# EAGLE design ArduTX_TX_Battery_Powered (EAGLE 6.6.0)
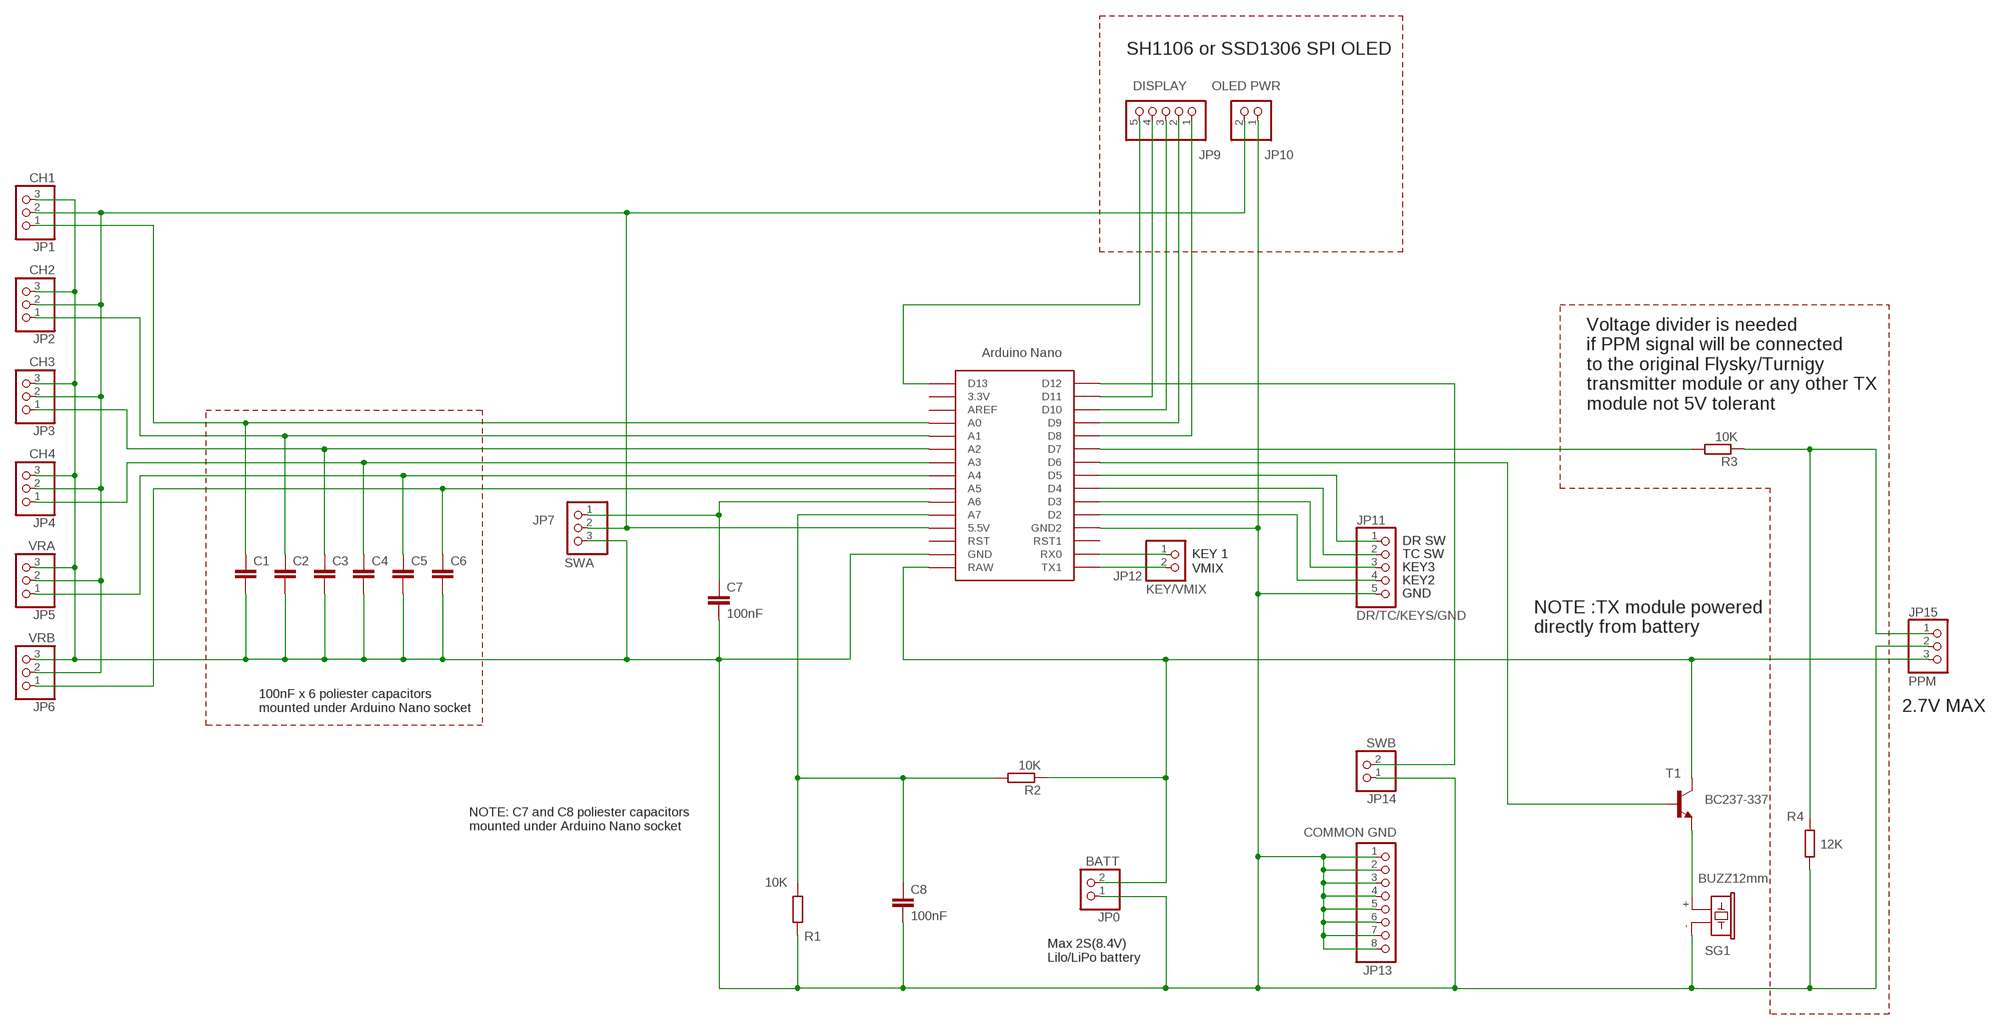
[diagram p0: schematic, sheet 1]

## Parts
ARDUINO-NANO  NANO  [NANO]
C1  C-EU050-025X075  [C050-025X075]
C2  C-EU050-025X075  [C050-025X075]
C3  C-EU050-025X075  [C050-025X075]
C4  C-EU050-025X075  [C050-025X075]
C5  C-EU050-025X075  [C050-025X075]
C6  C-EU050-025X075  [C050-025X075]
C7  100nF  C-EU050-025X075  [C050-025X075]
C8  100nF  C-EU050-025X075  [C050-025X075]
JP0  BATT  PINHD-1X2  [1X02]
JP1  CH1  PINHD-1X3  [1X03]
JP2  CH2  PINHD-1X3  [1X03]
JP3  CH3  PINHD-1X3  [1X03]
JP4  CH4  PINHD-1X3  [1X03]
JP5  VRA  PINHD-1X3  [1X03]
JP6  VRB  PINHD-1X3  [1X03]
JP7  SWA  PINHD-1X3  [1X03]
JP9  DISPLAY  PINHD-1X5  [1X05]
JP10  OLED PWR  PINHD-1X2  [1X02]
JP11  DR/TC/KEYS/GND  PINHD-1X5  [1X05]
JP12  KEY/VMIX  PINHD-1X2  [1X02]
JP13  COMMON GND  PINHD-1X8  [1X08]
JP14  SWB  PINHD-1X2  [1X02]
JP15  PPM  PINHD-1X3  [1X03]
R1  10K  R-EU_0207/8  [0207/8]
R2  10K  R-EU_0207/8  [0207/8]
R3  10K  R-EU_0207/8  [0207/8]
R4  12K  R-EU_0207/8  [0207/8]
SG1  BUZZ12mm  F/CM12P  [F/CM12P]
T1  BC237-337  BC337  [TO92]

## Nets
N$1: ARDUINO-NANO.TX0(TX1) JP12.2
N$2: ARDUINO-NANO.5V(5.5V) JP1.2 JP2.2 JP3.2 JP4.2 JP5.2 JP6.2 JP7.2 JP10.2
N$3: ARDUINO-NANO.A0 C1.1 JP1.1
N$4: ARDUINO-NANO.A1 C2.1 JP2.1
N$5: ARDUINO-NANO.A2 C3.1 JP3.1
N$6: ARDUINO-NANO.A3 C4.1 JP4.1
N$7: ARDUINO-NANO.A4 C5.1 JP5.1
N$8: ARDUINO-NANO.A5 C6.1 JP6.1
N$9: ARDUINO-NANO.D6 T1.2(B)
N$10: SG1.+ T1.1(E)
N$11: ARDUINO-NANO.D7 R3.2
N$12: ARDUINO-NANO.RX1(RX0) JP12.1
N$13: ARDUINO-NANO.D4 JP11.2
N$14: ARDUINO-NANO.D5 JP11.1
N$15: ARDUINO-NANO.A6 C7.1 JP7.1
N$16: ARDUINO-NANO.D3 JP11.3
N$17: ARDUINO-NANO.D2 JP11.4
N$20: ARDUINO-NANO.A7 C8.1 R1.1 R2.2
N$21: ARDUINO-NANO.D12 JP14.2
N$22: ARDUINO-NANO.GND ARDUINO-NANO.GND1(GND2) C1.2 C2.2 C3.2 C4.2 C5.2 C6.2 C7.2 C8.2 JP0.1 JP1.3 JP2.3 JP3.3 JP4.3 JP5.3 JP6.3 JP7.3 JP10.1 JP11.5 JP13.1 JP13.2 JP13.3 JP13.4 JP13.5 JP13.6 JP13.7 JP13.8 JP14.1 JP15.2 R1.2 R4.1 SG1.-
N$28: ARDUINO-NANO.D10 JP9.3
N$30: ARDUINO-NANO.D9 JP9.2
N$31: ARDUINO-NANO.D8 JP9.1
N$32: ARDUINO-NANO.D11 JP9.4
N$33: ARDUINO-NANO.D13 JP9.5
N$34: JP15.1 R3.1 R4.2
NET: ARDUINO-NANO.RAW JP0.2 JP15.3 R2.1 T1.3(C)
Unconnected: ARDUINO-NANO.3.3V ARDUINO-NANO.AREF ARDUINO-NANO.RST ARDUINO-NANO.RST1

## Notes on the sheet
- SH1106 or SSD1306 SPI OLED
- Voltage divider is needed 
  if PPM signal will be connected 
  to the original Flysky/Turnigy 
  transmitter module or any other TX
  module not 5V tolerant
- DR SW
- KEY 1 | TC SW
- VMIX | KEY3
- KEY2
- GND
- NOTE :TX module powered 
  directly from battery
- 100nF x 6 poliester capacitors
  mounted under Arduino Nano socket
- 2.7V MAX
- NOTE: C7 and C8 poliester capacitors
  mounted under Arduino Nano socket
- Max 2S(8.4V) 
  Lilo/LiPo battery

## Library data of the parts
ARDUINO-NANO = ArduTX:NANO: Arduino Nano
C1-C8 = ArduTX:C-EU: CAPACITOR, European symbol
JP0 JP10 JP12 JP14 = ArduTX:PINHD-1X2: PIN HEADER
JP1-JP7 JP15 = ArduTX:PINHD-1X3: PIN HEADER
JP9 JP11 = ArduTX:PINHD-1X5: PIN HEADER
JP13 = ArduTX:PINHD-1X8: PIN HEADER
R1-R4 = ArduTX:R-EU_: RESISTOR, European symbol
SG1 = ArduTX:F/CM12P: BUZZER Source: Buerklin; OC_FARNELL: unknown; OC_NEWARK: unknown
T1 = ArduTX:BC337*: NPN Transistor

## Board
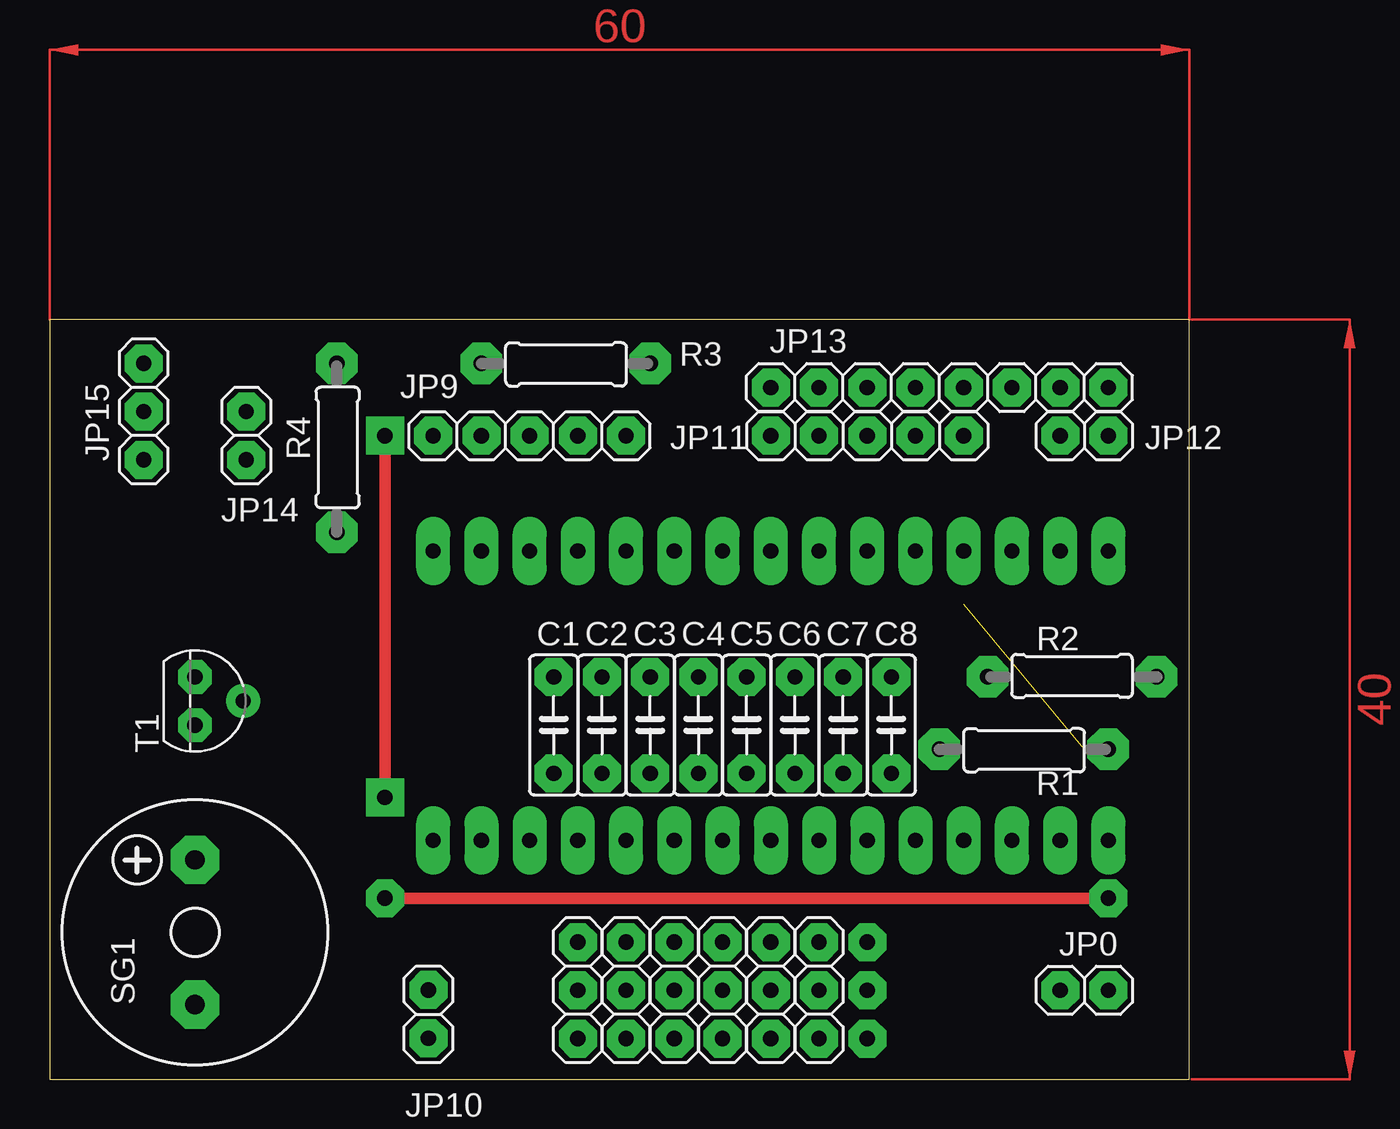
[diagram p1: board, top side]
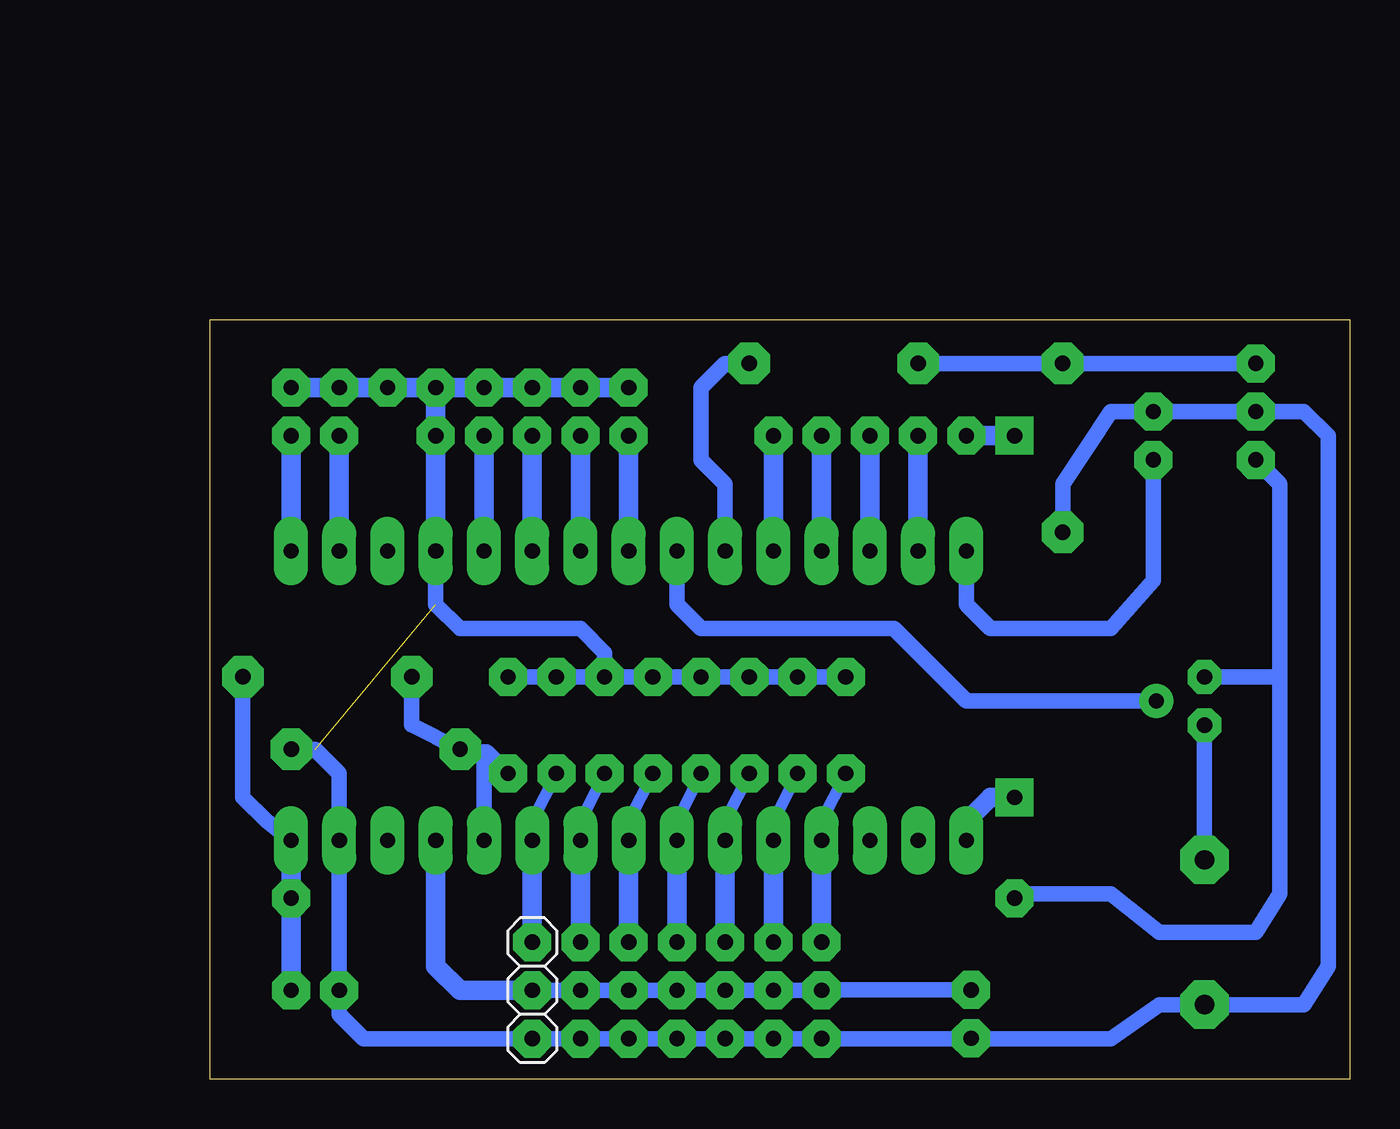
[diagram p2: board, bottom side, seen from below]

Size 60 x 40 mm. Coordinates in mm from the lower left corner, seen from the top.
Outline: 0,0 60,0 60,40 0,40 0,0
Copper layers (1*16): Top 0.035mm / dielectric 1.5mm / Bottom 0.035mm
Design rules "default": minimum track width 10mil, minimum drill 24mil, track to track 8mil, track to pad 8mil, pad to pad 8mil, via to via 8mil, smd to smd 8mil, copper to edge 40mil, drill to drill 8mil, minimum pad ring 10mil, minimum via ring 8mil, stop-mask expansion 4mil, vias tented up to drill 0mil, thermal gap 10mil

### Footprints (pad centres in the part's own frame; a part is rotated, then mirrored left to right if it is on the bottom)
NANO = drill 0.8 pad 1.8 long: 3.3V -10.16,24.13; 5V -10.16,-1.27; A0 -10.16,19.05; A1 -10.16,16.51; A2 -10.16,13.97; A3 -10.16,11.43; A4 -10.16,8.89; A5 -10.16,6.35; A6 -10.16,3.81; A7 -10.16,1.27; AREF -10.16,21.59; D2 5.08,1.27; D3 5.08,3.81; D4 5.08,6.35; D5 5.08,8.89; D6 5.08,11.43; D7 5.08,13.97; D8 5.08,16.51; D9 5.08,19.05; D10 5.08,21.59; D11 5.08,24.13; D12 5.08,26.67; D13 -10.16,26.67; GND -10.16,-6.35; GND1 5.08,-1.27; RAW -10.16,-8.89; RST -10.16,-3.81; RST1 5.08,-3.81; RX1 5.08,-6.35; TX0 5.08,-8.89
C050-025X075 = drill 0.8 pad 2 octagon: 1 -2.54,0; 2 2.54,0
1X02 = drill 0.8 pad 2 octagon: 1 -1.27,0; 2 1.27,0
1X03 = drill 0.8 pad 2 octagon: 1 -2.54,0; 2 0,0; 3 2.54,0
1X05 = drill 0.8 pad 2 octagon: 1 -5.08,0; 2 -2.54,0; 3 0,0; 4 2.54,0; 5 5.08,0
1X08 = drill 0.8 pad 2 octagon: 1 -8.89,0; 2 -6.35,0; 3 -3.81,0; 4 -1.27,0; 5 1.27,0; 6 3.81,0; 7 6.35,0; 8 8.89,0
0207/8 = drill 0.813 pad 2.184 octagon: 1 -3.81,0; 2 5.08,0
F/CM12P = drill 1.016 pad 2.54 octagon: + 3.81,0; - -3.81,0
TO92 = drill 0.8 pad 1.778 octagon: 1 1.27,0; 3 -1.27,0 | drill 0.8 pad 1.778: 2 0,2.54

### Placement (x,y rotation side)
ARDUINO-NANO  46.85,22.73 90 top
C1  26.53,18.64 90 top
C2  29.07,18.64 90 top
C3  31.61,18.64 90 top
C4  34.15,18.64 90 top
C5  36.69,18.64 90 top
C6  39.23,18.64 90 top
C7  41.77,18.64 90 top
C8  44.31,18.64 90 top
JP0  54.47,4.67 0 top
JP1  27.8,4.67 270 top
JP2  30.34,4.67 270 top
JP3  32.88,4.67 270 top
JP4  35.42,4.67 270 top
JP5  37.96,4.67 270 top
JP6  40.5,4.67 270 top
JP7  43.04,4.67 270 bottom
JP9  25.26,33.88 180 top
JP10  19.93,3.42 90 top
JP11  43.04,33.88 0 top
JP12  54.47,33.88 0 top
JP13  46.85,36.42 180 top
JP14  10.34,33.88 270 top
JP15  4.94,35.15 270 top
R1  50.65,17.37 0 top
R2  54.47,21.18 180 top
R3  26.53,37.69 0 top
R4  15.1,32.61 90 top
SG1  7.64,7.73 90 top
T1  7.64,19.91 270 top

### Tracks (layer width: path | path; a pad name or v marks a point on that pad's centre or on a via)
N$1
  Bottom 1.016: JP12.2 ARDUINO-NANO.TX0
N$2
  Bottom 0.813: JP7.2 JP6.2 JP5.2 JP4.2 JP3.2 JP2.2 JP1.2 27.78,4.69 JP10.2 19.91,4.67
  Bottom 1.016: JP7.2 46.85,4.67 48.12,5.94 ARDUINO-NANO.5V
N$3
  Bottom 0.61: C1.1 27.8,13.56 ARDUINO-NANO.A0
  Bottom 1.016: ARDUINO-NANO.A0 JP1.1
N$4
  Bottom 0.61: C2.1 30.34,13.56 ARDUINO-NANO.A1
  Bottom 1.016: ARDUINO-NANO.A1 JP2.1
N$5
  Bottom 0.61: C3.1 32.88,13.56 ARDUINO-NANO.A2
  Bottom 1.016: ARDUINO-NANO.A2 JP3.1
N$6
  Bottom 0.61: C4.1 35.42,13.56 ARDUINO-NANO.A3
  Bottom 1.016: ARDUINO-NANO.A3 JP4.1
N$7
  Bottom 0.61: C5.1 37.96,13.56 ARDUINO-NANO.A4
  Bottom 1.016: ARDUINO-NANO.A4 JP5.1
N$8
  Bottom 0.61: C6.1 40.5,13.56 ARDUINO-NANO.A5
  Bottom 1.016: ARDUINO-NANO.A5 JP6.1
N$9
  Bottom 0.813: ARDUINO-NANO.D6 35.42,24.99 34.15,23.72 23.99,23.72 20.18,19.91 T1.2
N$10
  Bottom 0.813: T1.1 SG1.+
N$11
  Bottom 0.813: ARDUINO-NANO.D7 32.88,31.34 34.15,32.61 34.15,36.42 32.88,37.69 R3.2
N$12
  Bottom 1.016: JP12.1 ARDUINO-NANO.RX1
N$13
  Bottom 1.016: JP11.2 ARDUINO-NANO.D4
N$14
  Bottom 1.016: JP11.1 ARDUINO-NANO.D5
N$15
  Bottom 0.61: C7.1 43.04,13.56 ARDUINO-NANO.A6
  Bottom 1.016: ARDUINO-NANO.A6 JP7.1
N$16
  Bottom 1.016: JP11.3 ARDUINO-NANO.D3
N$17
  Bottom 1.016: JP11.4 ARDUINO-NANO.D2
N$20
  Bottom 0.61: 46.71,17.24 R1.1
  Bottom 0.813: R1.1 49.39,18.64 R2.2 | 46.71,17.24 45.58,17.24 | 45.58,17.24 45.45,17.24 C8.1 | ARDUINO-NANO.A7 45.58,17.24
N$21
  Bottom 0.813: ARDUINO-NANO.D12 20.18,24.99 18.91,23.72 12.56,23.72 10.34,26.26 JP14.2
N$22  (1 unrouted)
  Bottom 0.813: 19.93,2.13 JP1.3 JP2.3 JP3.3 JP4.3 JP5.3 JP6.3 JP7.3 51.93,2.13 53.2,3.4 JP0.1 ARDUINO-NANO.GND 53.2,16.1 54.47,17.37 R1.2 | 19.91,2.13 JP10.1 19.93,2.13 | 19.93,2.13 12.56,2.13 10.02,3.92 SG1.- 2.4,3.92 1.13,5.94 1.13,33.88 2.4,35.15 JP15.2 JP14.1 12.56,35.15 15.1,31.34 R4.1 | ARDUINO-NANO.GND1 48.12,24.99 46.85,23.72 40.5,23.72 39.23,22.45 C6.2 | C1.2 C2.2 C3.2 C4.2 C5.2 C6.2 | C6.2 C7.2 C8.2
  Bottom 1.016: ARDUINO-NANO.GND1 JP11.5 JP13.4 | JP13.8 JP13.7 JP13.6 JP13.5 JP13.4 | JP13.4 JP13.3 JP13.2 JP13.1
N$28
  Bottom 1.016: JP9.3 ARDUINO-NANO.D10
N$30
  Bottom 1.016: JP9.2 ARDUINO-NANO.D9
N$31
  Bottom 1.016: JP9.1 ARDUINO-NANO.D8
N$32
  Bottom 1.016: JP9.4 ARDUINO-NANO.D11
N$33  (via drill 0.8 pad 2)
  Top 0.61: v17.64,33.88 v17.64,14.83
  Bottom 1.016: JP9.5 v17.64,33.88 | ARDUINO-NANO.D13 20.18,13.56 18.91,14.83 v17.64,14.83
N$34
  Bottom 0.813: JP15.1 R4.2 R3.1
NET  (via drill 0.8 pad 2)
  Top 0.61: v55.74,9.53 v17.64,9.53
  Bottom 0.813: v17.64,9.53 17.62,9.75 12.56,9.75 10.02,7.73 4.94,7.73 3.67,9.75 3.67,21.18 | R2.1 58.28,14.83 57.01,13.56 ARDUINO-NANO.RAW | T1.3 3.67,21.18 | JP15.3 3.67,31.34 3.67,21.18
  Bottom 1.016: JP0.2 v55.74,9.53 ARDUINO-NANO.RAW
(copper drawn outside any net)
  shapes: Top area x2

### Text on the board
TEXT: OLED13 | OLED11 | OLED10 | OLED9 | OLED8 | DR SW | TC SW | KEY3 | KEY2 | GND | GND | KEY1 | VMIX